# EAGLE design heater (EAGLE 6.3)
Rabbithouse heater PWM controller
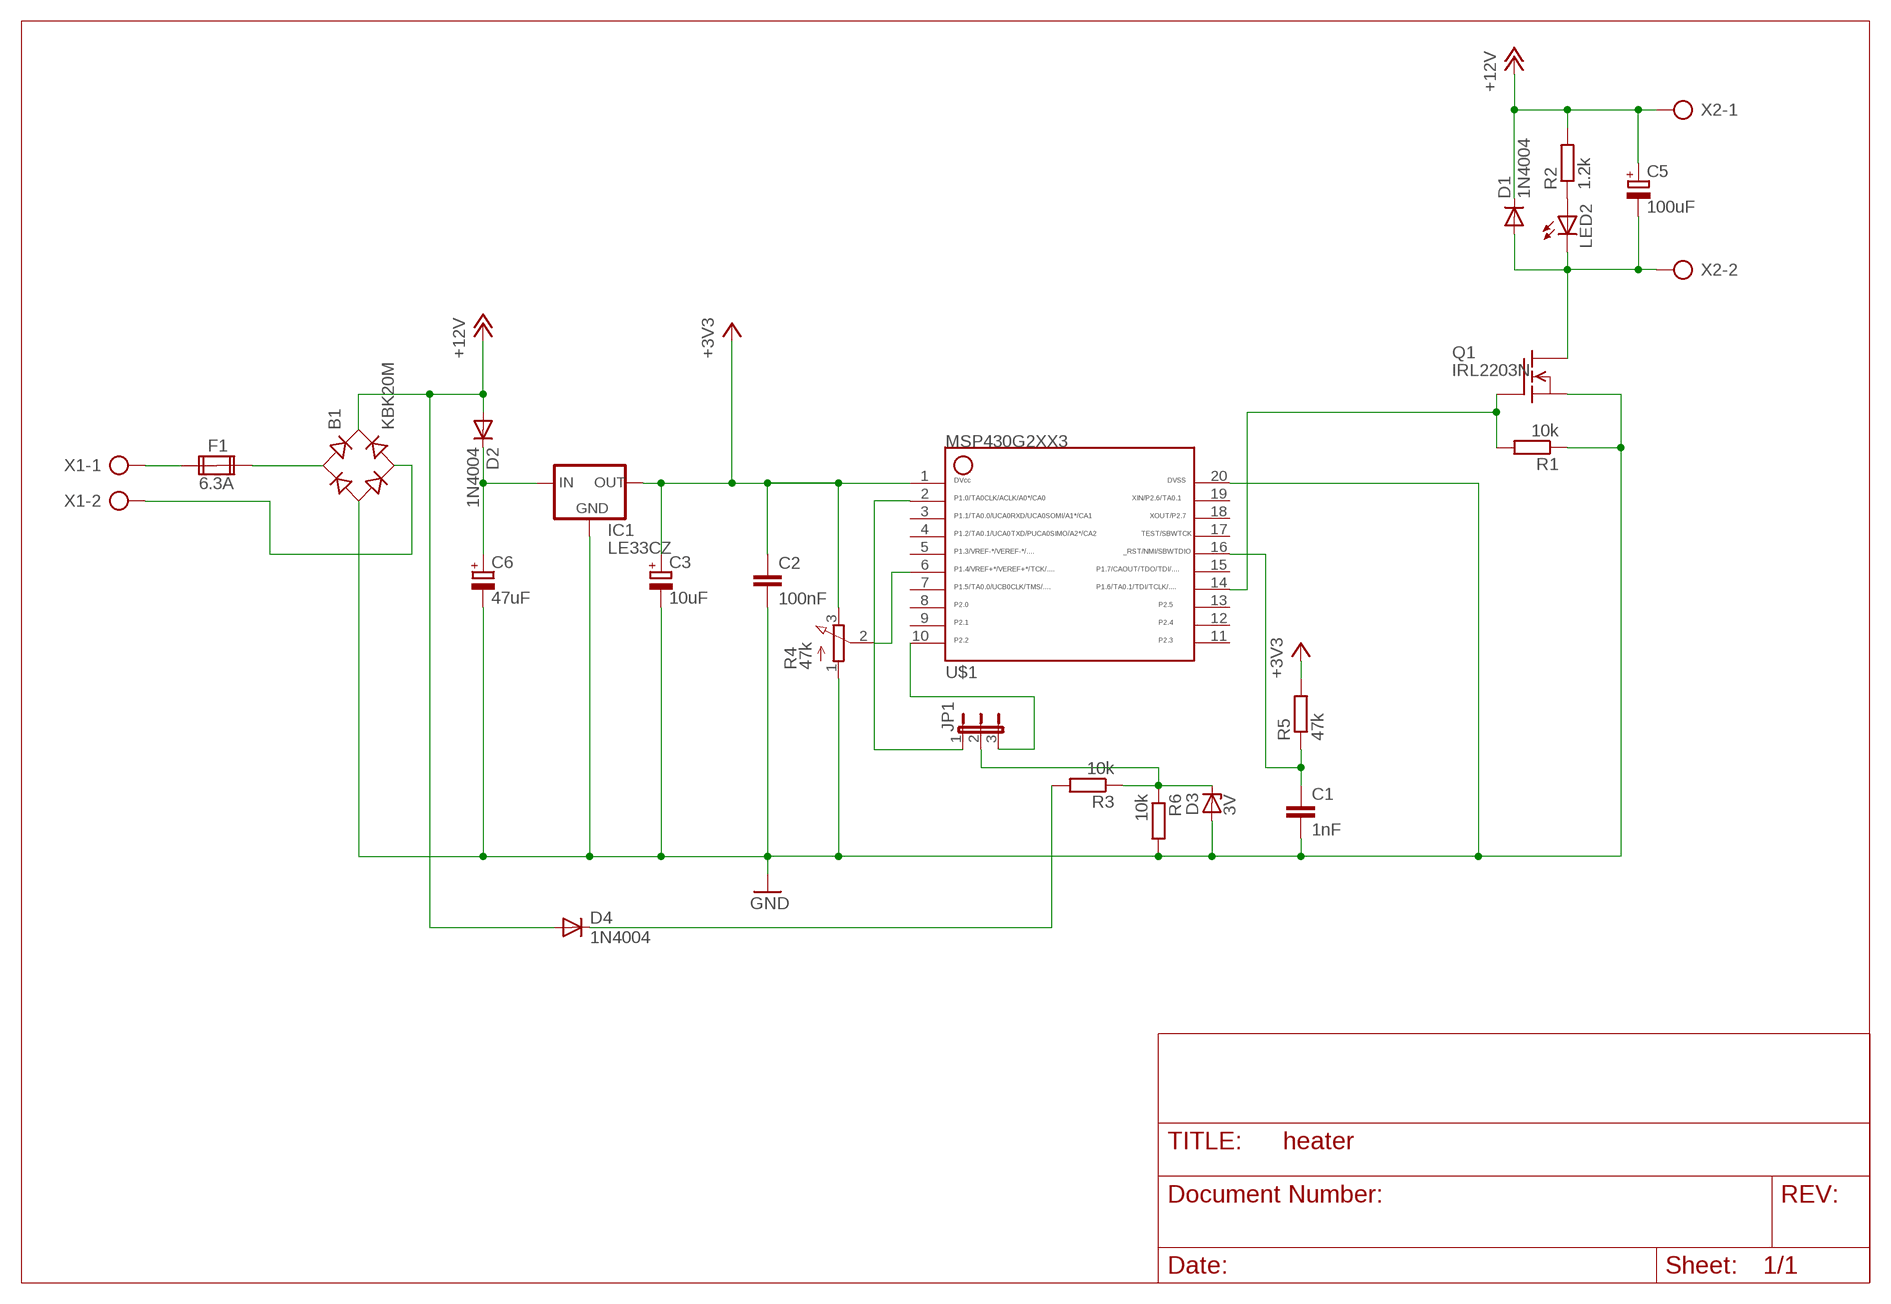
[diagram p0: schematic, sheet 1]

## Parts
B1  KBK20M  RECTIFIER-SKB32  [SKB32]
C1  1nF  C-EU050-024X044  [C050-024X044]
C2  100nF  C-EU050-024X044  [C050-024X044]
C3  10uF  CPOL-EUE2,5-6E  [E2,5-6E]
C5  100uF  CPOL-EUE2,5-6E  [E2,5-6E]
C6  47uF  CPOL-EUE2,5-6E  [E2,5-6E]
D1  1N4004  [DO41-10]
D2  1N4004  [DO41-10]
D3  3V  ZENER-DIODEDO35Z10  [DO35Z10]
D4  1N4004  [DO41-10]
F1  6.3A  FUSE2P  [FUSE1]
IC1  LE33CZ  LP2950ACZ-3.3  [TO92]
JP1  JP2W  [JP2W]
LED2  LED5MM  [LED5MM]
Q1  IRL2203N  IRF540  [TO220]
R1  10k  R-EU_0207/10  [0207/10]
R2  1.2k  R-EU_0207/10  [0207/10]
R3  10k  R-EU_0207/10  [0207/10]
R4  47k  3RP/1610N  [3RP/1610N]
R5  47k  R-EU_0207/10  [0207/10]
R6  10k  R-EU_0207/10  [0207/10]
U$1  MSP430G2533  G2XX3---N20  [N20]
X1  AK500/2  [AK500/2]
X2  AK500/2  [AK500/2]

## Nets
+3V3: C2.1 C3.+ IC1.1(OUT) R4.3(E) R5.2 U$1.1
+12V [power]: B1.+ C5.+ D1.C D2.A D4.A R2.2 X2.1
GND [power]: B1.- C1.2 C2.2 C3.- C6.- D3.A IC1.2(GND) Q1.3(S) R1.1 R4.1(A) R6.2 U$1.20
N$1 [power]: F1.1A X1.1
N$2 [power]: B1.AC1 F1.2A
N$3 [power]: B1.AC2 X1.2
N$4: LED2.A R2.1
N$5: Q1.1(G) R1.2 U$1.14
N$6: R4.2(S) U$1.6
N$7 [power]: C5.- D1.A LED2.K(C) Q1.2(D) X2.2
N$8: D3.C JP1.2 R3.1 R6.1
N$9: C1.1 R5.1 U$1.16
N$10 [power]: D4.C R3.2
N$11 [power]: C6.+ D2.C IC1.3(IN)
N$12: JP1.3 U$1.10
N$13: JP1.1 U$1.2
Unconnected: F1.1B F1.2B U$1.3 U$1.4 U$1.5 U$1.7 U$1.8 U$1.9 U$1.11 U$1.12 U$1.13 U$1.15 U$1.17 U$1.18 U$1.19

## Library data of the parts
B1 = rectifier:RECTIFIER-: Rectifier
C1 C2 = resistor:C-EU: CAPACITOR, European symbol
C3 C5 C6 = resistor:CPOL-EU: POLARIZED CAPACITOR, European symbol
D1 D2 D4 = diode:1N4004: DIODE general purpose rectifier, 1 A
D3 = diode:ZENER-DIODE: Z-Diode
F1 = special:FUSE2P: FUSE 5 x 20 mm
IC1 = v-reg:LP2950?*: Source: http://cache.national.com/ds/LP/LP2950.pdf
JP1 = jumper:JP2W: JUMPER
LED2 = led:LED: LED OSRAM: - CHIPLED LG R971, LG N971, LY N971, LG Q971, LY Q971, LO R971, LY R971 LH N974, LH R974 LS Q976, LO Q976, LY Q976 LO Q996 - Hyper CHIPLED LW Q18S LB Q993, LB Q99A, LB R99A - SideLED LS A670, LO A670, LY A670, LG A670, LP A670 LB A673, LV A673, LT A673, LW A673 LH A674 LY A675 LS A676, LA A676, LO A676, LY A676, LW A676 LS A679, LY A679, LG A679 - Hyper Micro SIDELED® LS Y876, LA Y876, LO Y876, LY Y876 LT Y87S - SmartLED LW L88C, LW L88S LB L89C, LB L89S, LG L890 LS L89K, LO L89K, LY L89K LS L896, LA L896, LO L896, LY L896 - TOPLED LS T670, LO T670, LY T670, LG T670, LP T670 LSG T670, LSP T670, LSY T670, LOP T670, LYG T670 LG T671, LOG T671, LSG T671 LB T673, LV T673, LT T673, LW T673 LH T674 LS T676, LA T676, LO T676, LY T676, LB T676, LH T676, LSB T676, LW T676 LB T67C, LV T67C, LT T67C, LS T67K, LO T67K, LY T67K, LW E67C LS E67B, LA E67B, LO E67B, LY E67B, LB E67C, LV E67C, LT E67C LW T67C LS T679, LY T679, LG T679 LS T770, LO T770, LY T770, LG T770, LP T770 LB T773, LV T773, LT T773, LW T773 LH T774 LS E675, LA E675, LY E675, LS T675 LS T776, LA T776, LO T776, LY T776, LB T776 LHGB T686 LT T68C, LB T68C - Hyper Mini TOPLED® LB M676 - Mini TOPLED Santana® LG M470 LS M47K, LO M47K, LY M47K Source: http://www.osram.convergy.de LUXEON: - LUMILED® LXK2-PW12-R00, LXK2-PW12-S00, LXK2-PW14-U00, LXK2-PW14-V00 LXK2-PM12-R00, LXK2-PM12-S00, LXK2-PM14-U00 LXK2-PE12-Q00, LXK2-PE12-R00, LXK2-PE12-S00, LXK2-PE14-T00, LXK2-PE14-U00 LXK2-PB12-K00, LXK2-PB12-L00, LXK2-PB12-M00, LXK2-PB14-N00, LXK2-PB14-P00, LXK2-PB14-Q00 LXK2-PR12-L00, LXK2-PR12-M00, LXK2-PR14-Q00, LXK2-PR14-R00 LXK2-PD12-Q00, LXK2-PD12-R00, LXK2-PD12-S00 LXK2-PH12-R00, LXK2-PH12-S00 LXK2-PL12-P00, LXK2-PL12-Q00, LXK2-PL12-R00 Source: www.luxeon.com KINGBRIGHT: KA-3528ASYC Source: www.kingbright.com
Q1 = transistor-fet:IRF540: N-Channel Enhancement MOSFET (HEXFET); 100V; 28A; 0,077Ohm
R1-R3 R5 R6 = rcl:R-EU_: RESISTOR, European symbol
R4 = pot:3RP/1610N: 16mm Potentiometer one level Source: http://www.alphapotentiometers.net/html/16mm_pot_2.html
U$1 = TI_MSP430_v16_asu:G2XX3---N20: MSP430G2XX1 PDIP (N) 20 Pin Package
X1 X2 = con-ptr500:AK500/2: CONNECTOR; OC_FARNELL: unknown; OC_NEWARK: unknown

## Net classes
1 power: width 1.27 mm, clearance 0.254 mm

## Board
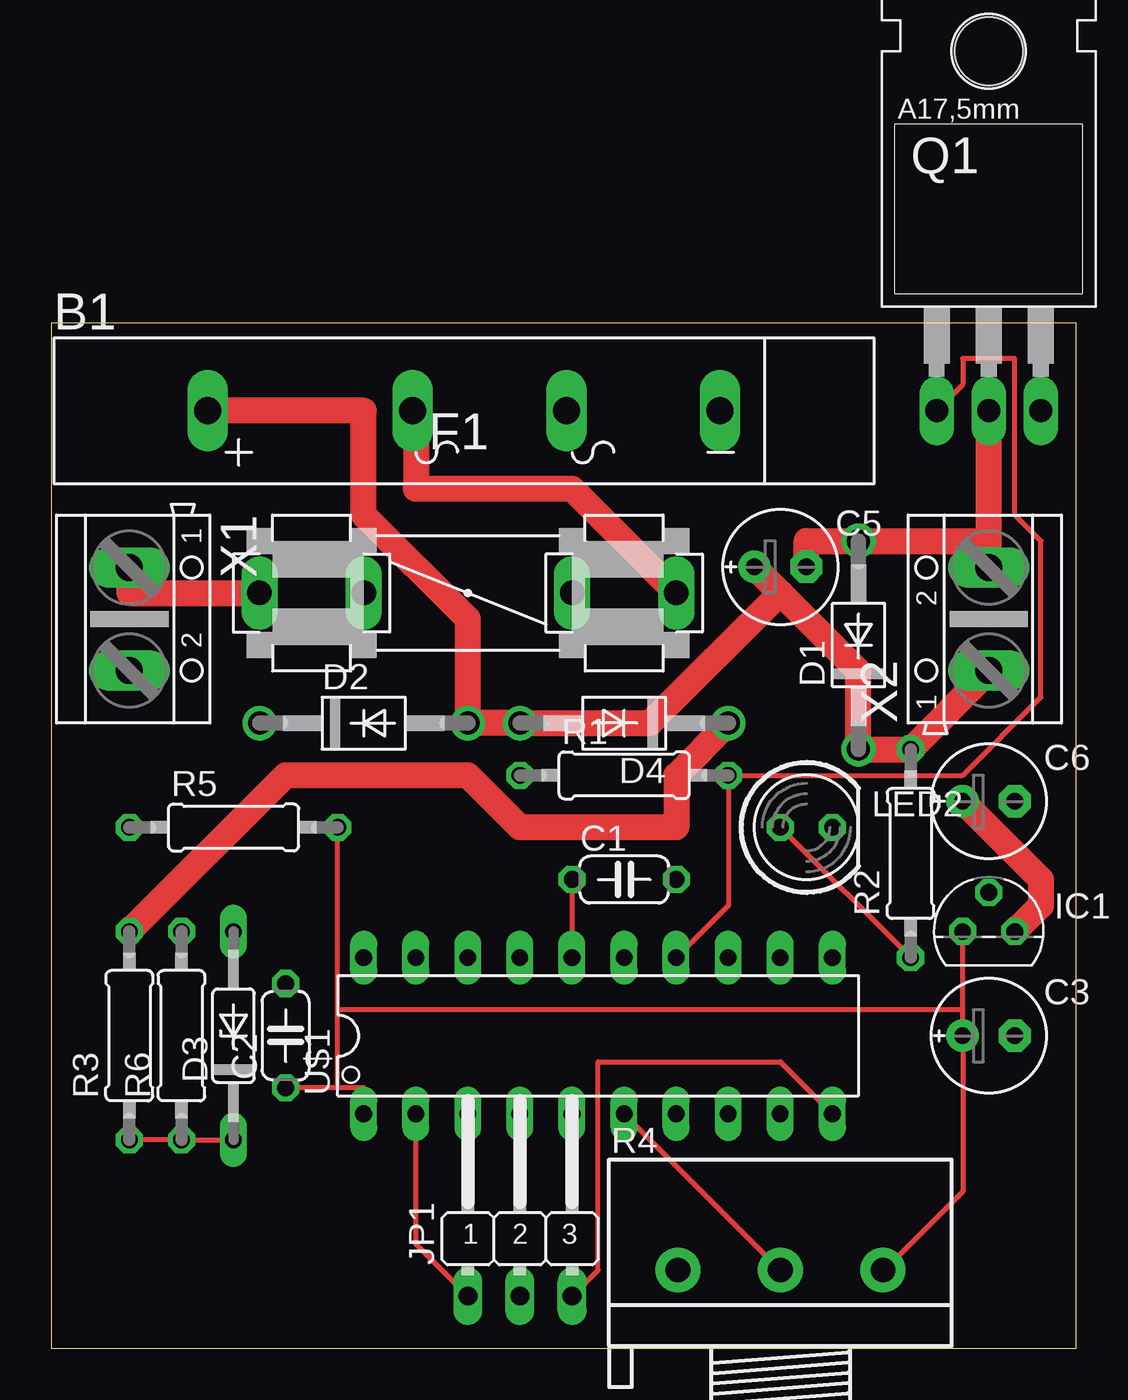
[diagram p1: board, top side]
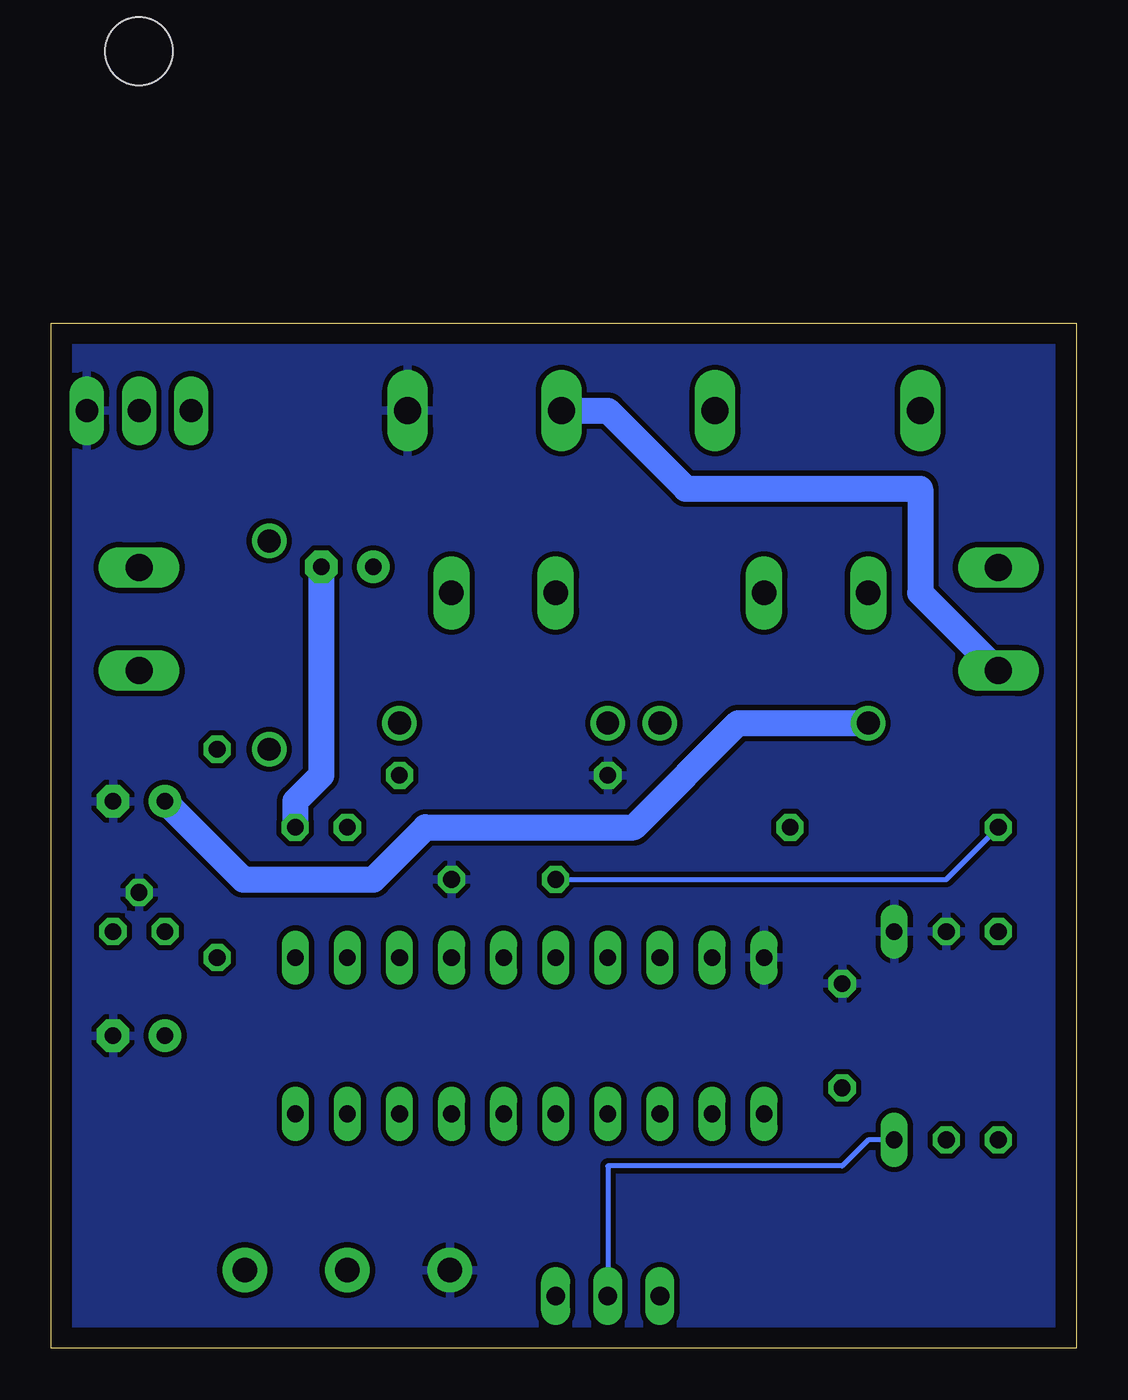
[diagram p2: board, bottom side, seen from below]

Size 50 x 50 mm. Coordinates in mm from the lower left corner, seen from the top.
Outline: 0,0 50,0 50,50 0,50 0,0
Copper layers (1*16): Top 0.035mm / dielectric 1.5mm / Bottom 0.035mm
Design rules "default": minimum track width 10mil, minimum drill 24mil, track to track 8mil, track to pad 8mil, pad to pad 8mil, via to via 8mil, smd to smd 8mil, copper to edge 40mil, drill to drill 8mil, minimum pad ring 10mil, minimum via ring 8mil, stop-mask expansion 4mil, vias tented up to drill 0mil, thermal gap 10mil

### Footprints (pad centres in the part's own frame; a part is rotated, then mirrored left to right if it is on the bottom)
SKB32 = drill 1.321 long: + -13.97,0; - 11.024,0; AC1 -3.962,0; AC2 3.531,0
C050-024X044 = drill 0.813 octagon: 1 -2.54,0; 2 2.54,0
E2,5-6E = drill 0.813 pad 1.575: + -1.27,0 | drill 0.813 pad 1.575 octagon: - 1.27,0
DO41-10 = drill 1.118: A 5.08,0; C -5.08,0
DO35Z10 = drill 0.813 long: A 5.08,0; C -5.08,0
FUSE1 = drill 1.194 long: 1A -10.16,0; 1B -5.08,0; 2A 10.16,0; 2B 5.08,0
TO92 = drill 0.813 octagon: 1 -1.27,0; 2 0,1.905; 3 1.27,0
JP2W = drill 0.914 long: 1 -2.54,-1.27; 2 0,-1.27; 3 2.54,-1.27
LED5MM = drill 0.813 octagon: A -1.27,0; K 1.27,0
TO220 = drill 1.118 long: 1 -2.54,-6.35; 2 0,-6.35; 3 2.54,-6.35 | hole 3.302: 0,11.176
0207/10 = drill 0.813 octagon: 1 -5.08,0; 2 5.08,0
3RP/1610N = drill 1.2 pad 2.184: 1 -5,0; 2 0,0; 3 5,0
N20 = drill 0.813 long: 1 -11.435,-3.81; 2 -8.895,-3.81; 3 -6.355,-3.81; 4 -3.815,-3.81; 5 -1.275,-3.81; 6 1.265,-3.81; 7 3.805,-3.81; 8 6.345,-3.81; 9 8.885,-3.81; 10 11.425,-3.81; 11 11.425,3.81; 12 8.885,3.81; 13 6.345,3.81; 14 3.805,3.81; 15 1.265,3.81; 16 -1.275,3.81; 17 -3.815,3.81; 18 -6.355,3.81; 19 -8.895,3.81; 20 -11.435,3.81
AK500/2 = drill 1.321 long: 1 -2.515,0; 2 2.515,0

### Placement (x,y rotation side)
B1  21.59,45.72 0 top
C1  27.94,22.86 0 top
C2  11.43,15.24 90 top
C3  45.72,15.24 0 top
C5  35.56,38.1 0 top
C6  45.72,26.67 0 top
D1  39.37,34.29 90 top
D2  15.24,30.48 0 top
D3  8.89,15.24 90 top
D4  27.94,30.48 180 top
F1  20.32,36.83 0 top
IC1  45.72,20.32 0 top
JP1  22.86,3.81 0 top
LED2  36.83,25.4 0 top
Q1  45.72,52.07 0 top
R1  27.94,27.94 0 top
R2  41.91,24.13 90 top
R3  3.81,15.24 90 top
R4  35.56,3.81 0 top
R5  8.89,25.4 0 top
R6  6.35,15.24 90 top
U$1  26.67,15.24 0 top
X1  3.81,35.56 270 top
X2  45.72,35.56 90 top

### Tracks (layer width: path | path; a pad name or v marks a point on that pad's centre or on a via)
+3V3
  Top 0.254: 13.97,12.7 15.24,12.7 U$1.1 | 13.97,12.7 C2.1 | 13.97,12.7 13.97,16.51 | 13.97,16.51 R5.2 | 44.45,16.51 C3.+ 44.45,7.62 40.64,3.81 R4.3 | 44.45,16.51 IC1.1 | 44.45,16.51 13.97,16.51
+12V
  Top 1.27: 35.56,36.83 39.37,33.02 D1.C R2.2 45.72,33.02 X2.1 | 35.56,36.83 C5.+ | B1.+ 15.24,45.72 15.24,40.64 20.32,35.56 D2.A D4.A 29.21,30.48 35.56,36.83
GND
  pour Bottom: 0,50.8 50.8,50.8 50.8,0 0,0
N$1
  Top 1.27: F1.1A 3.81,36.83 X1.1 3.81,38.1
N$2
  Top 1.27: F1.2A 25.4,41.91 17.78,41.91 17.78,45.72 B1.AC1
N$3
  Bottom 1.27: X1.2 3.81,33.02 7.62,36.83 7.62,41.91 19.05,41.91 22.86,45.72 B1.AC2 25.4,45.72
N$4
  Top 0.254: LED2.A R2.1
N$5
  Top 0.254: U$1.14 33.02,21.59 R1.2 44.45,27.94 48.26,31.75 48.26,39.37 46.99,40.64 46.99,48.26 44.45,48.26 44.45,46.99 Q1.1
N$6
  Top 0.254: R4.2 U$1.6
N$7
  Top 1.27: X2.2 45.72,39.37 | 45.72,39.37 Q1.2 | C5.- 36.83,39.37 D1.A 45.72,39.37
  Bottom 1.27: LED2.K 38.1,26.67 36.83,27.94 C5.-
N$8
  Top 0.254: R3.1 R6.1 D3.C
  Bottom 0.254: JP1.2 22.86,8.89 11.43,8.89 10.16,10.16 D3.C
N$9
  Top 0.254: C1.1 U$1.16
  Bottom 0.254: R5.1 6.35,22.86 C1.1
N$10
  Top 1.27: R3.2 11.43,27.94 20.32,27.94 22.86,25.4 30.48,25.4 30.48,27.94 D4.C
N$11
  Top 1.27: IC1.3 48.26,21.59 48.26,22.86 C6.+
  Bottom 1.27: D2.C 16.51,30.48 21.59,25.4 31.75,25.4 34.29,22.86 40.64,22.86 C6.+
N$12
  Top 0.254: JP1.3 26.67,3.81 26.67,13.97 35.56,13.97 U$1.10
N$13
  Top 0.254: JP1.1 17.78,5.08 U$1.2